# Altium schematic sheet 3V3-CAN.SchDoc
size A4; Organization: UNSW Solar Racing Team; Address3: UNSW; Address4: Sydney NSW 2052; Address2: Electrical Engineering; Address1: Rm 109
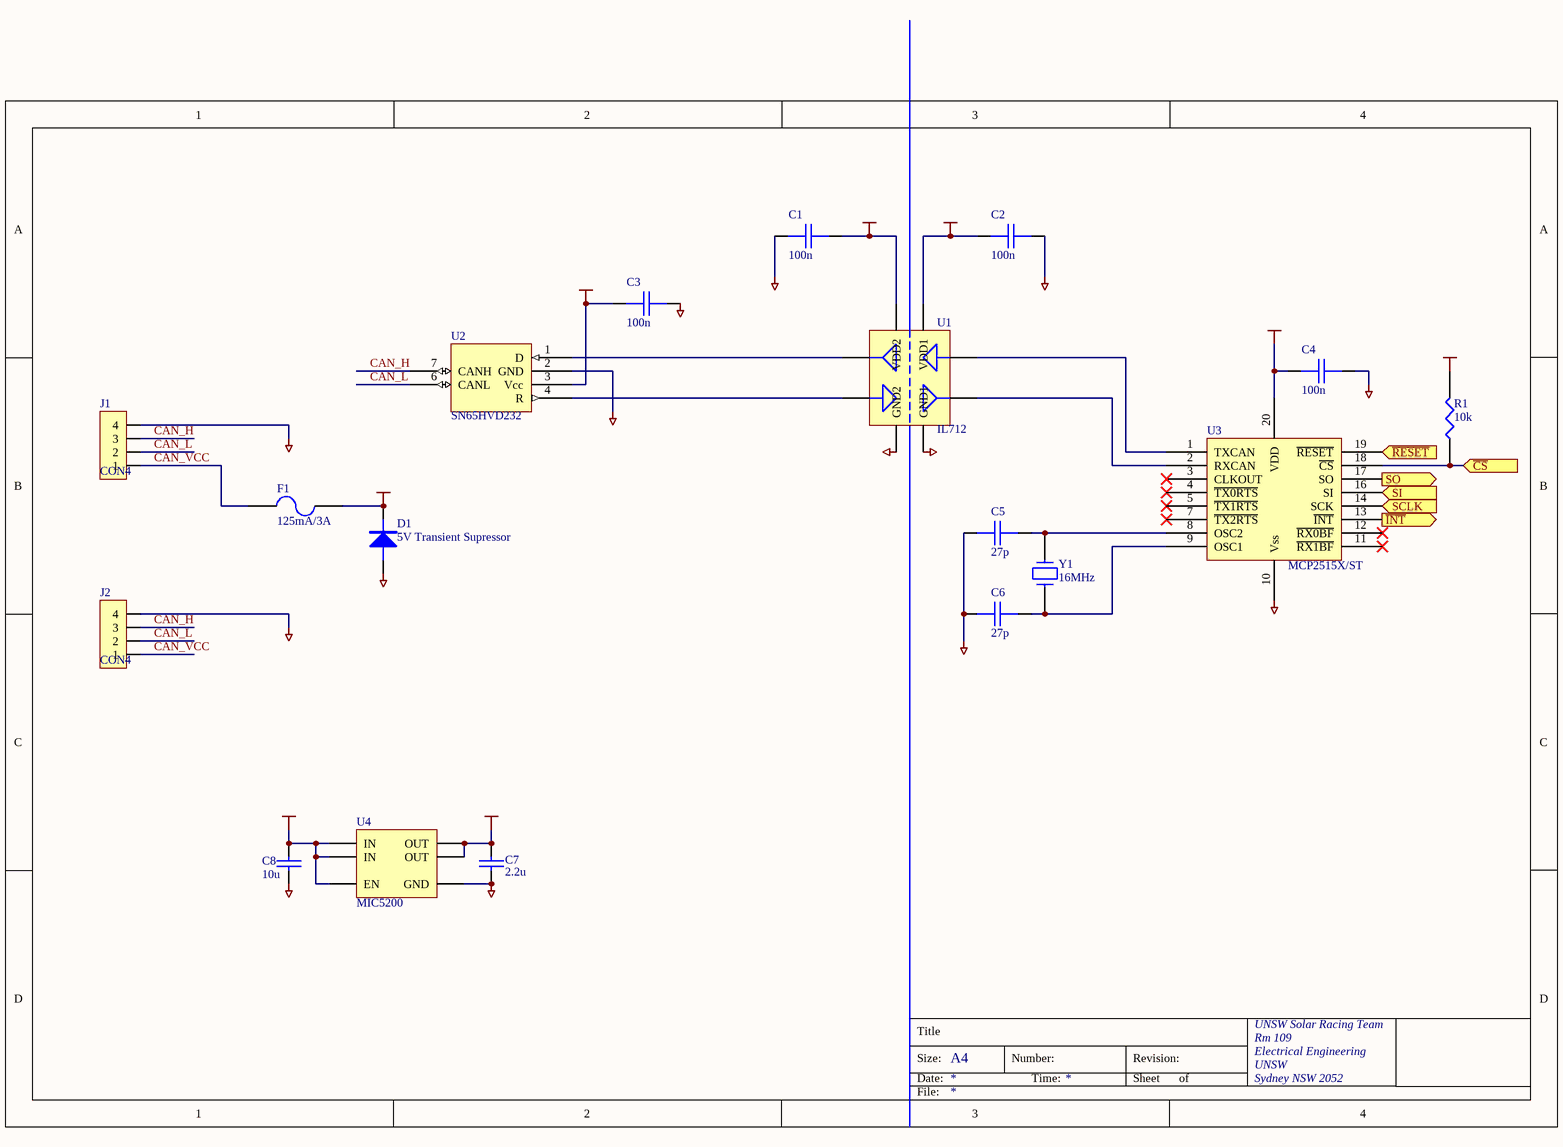
[diagram p0: 3V3-CAN.SchDoc]

## Parts
C1  100n  [0603]
C2  100n  [0603]
C3  100n  [0603]
C4  100n  [0603]
C5  27p  [0603]
C6  27p  [0603]
C7  2.2u  [MCCT-CASEA]
C8  10u  [MCCT-CASEB]
D1  5V Transient Supressor  [SMA]
F1  125mA/3A  [LITTELFUSE-154]
J1  CON4  [WEIDMULLER-SL3.5/4/90G]
J2  CON4  [WEIDMULLER-SL3.5/4/90G]
R1  10k  [0603]
U1  IL712  [SO8]
U2  SN65HVD232  [SO8]
U3  MCP2515X/ST  [TSSOP20]
U4  MIC5200  [SO8]
Y1  16MHz  [HC49/4H]

## Ports
SCLK (in), SI (in), SO (out), ~{CS} (in), ~{INT} (out), ~{RESET} (in)

## Nets
3V3: C2.2 C4.1 R1.2 U1.1(VDD1) U3.20(VDD)
CAN_3V3: C1.2 C3.2 C7.2 U1.8(VDD2) U2.3(Vcc) U4.1(OUT) U4.2(OUT)
CAN_5V: C8.1 D1.K F1.2 U4.5(EN) U4.7(IN) U4.8(IN)
CAN_GND: C1.1 C3.1 C7.1 C8.2 D1.A J1.4 J2.4 U1.5(GND2) U2.2(GND) U4.4(GND)
GND: C2.1 C4.2 C5.1 C6.1 U1.4(GND1) U3.10(Vss)
~{CS}: R1.1 U3.18(~{CS}) ; port ~{CS}
CAN_H: J1.3 J2.3 U2.7(CANH)
CAN_L: J1.2 J2.2 U2.6(CANL)
CAN_VCC: F1.1 J1.1 J2.1
~{INT}: U3.13(~{INT}) ; port ~{INT}
~{RESET}: U3.19(~{RESET}) ; port ~{RESET}
SCLK: U3.14(SCK) ; port SCLK
SI: U3.16(SI) ; port SI
SO: U3.17(SO) ; port SO
NetC5_2: C5.2 U3.8(OSC2) Y1.1
NetC6_2: C6.2 U3.9(OSC1) Y1.2
NetU1_2: U1.2(IN1) U3.1(TXCAN)
NetU1_3: U1.3(OUT2) U3.2(RXCAN)
NetU1_6: U1.6(IN2) U2.4(R)
NetU1_7: U1.7(OUT1) U2.1(D)

Not connected (* = marked no-connect by the designer): U3 3(CLKOUT)* 4(~{TX0RTS})* 5(~{TX1RTS})* 7(~{TX2RTS})* 11(~{RX1BF})* 12(~{RX0BF})*

## Notes on the sheet
- Title
- Size:
- Date:
- A4
- Number:
- Time:
- Revision:
- Sheet
- of
- File:

## Library data of the parts
C1 C2 C4 = CAP: Capacitor; something: 0.31; note: Purchase a reel.; Farnell: 753-567; Price: 0.30
C3 = CAP: Capacitor; something: 0.31; Note: Purchase a reel.; Farnell: 753-567; Price: 0.30
C5 C6 C8 = CAP: Capacitor
  C5 C6: Farnell - 15pF: 721-980; Farnell: 722-017; Price: 0.30
  C8: Farnell: 967-117; Price: 1.45
C7 = CAP: Capacitor; Something: 0.938; Farnell: 967-099; Supplier: Farnell.; Price: 0.938
D1 = DIODE
F1 = FUSE2: Fuse; value: 154-375T (Holder + 125mA fuse) AND 0454 003 (3A Fuse); website: www.littelfuse.com; Farnell: 664-819; Price: 7.87
J1 J2 = CON4: Connector; Farnell: 617-477; Price: 2.05
R1 = RES1: Farnell: 612-601; Price: 0.11
U1 = IL712: IL712 Optoisolator - www.nve.com; Part Field 2: 12.00; Part Field 3: Trade Tech - IL712-3; Part Field 4: simon.cope@tradetech.co.nz; Farnell: NA
U2 = SN65HVD232: 3.3V CAN Transciever; Part Field 2: 5.00; Part Field 3: www.ti.com - Texas Instruments; Farnell: NA
U3 = MCP2515X/ST: MCP2510 CAN Controller; Farnell: NA
U4 = MIC5200: MIC5200 - SO8; Part Field 2: 2.00; Part Field 3: Computer Science and Engineering; Part Field 4: David Johnson; Farnell: 572-111; Price: 10.72
Y1 = CRYSTAL: Farnell SMD: 639-588; Farnell: 485-093; Price: 2.61